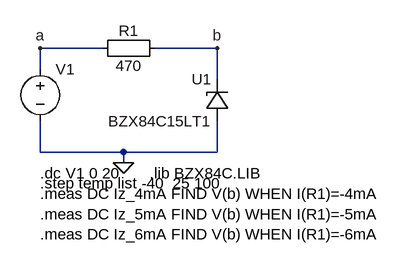
[diagram p0: schematic zener_va_15v.asc]
zener_va_15v.asc, the LTspice schematic file:
Version 4
SHEET 1 880 680
WIRE 112 -256 16 -256
WIRE 288 -256 192 -256
WIRE 16 -224 16 -256
WIRE 288 -208 288 -256
WIRE 16 -96 16 -144
WIRE 144 -96 16 -96
WIRE 288 -96 288 -144
WIRE 288 -96 144 -96
WIRE 144 -80 144 -96
FLAG 144 -80 0
FLAG 16 -256 a
FLAG 288 -256 b
SYMBOL Misc\\EuropeanResistor 208 -272 R90
WINDOW 0 5 56 VBottom 2
WINDOW 3 27 56 VTop 2
SYMATTR InstName R1
SYMATTR Value 470
SYMBOL zener-macro-model 304 -144 R180
WINDOW 0 24 64 Left 2
WINDOW 3 24 0 Left 2
SYMATTR InstName U1
SYMATTR Value BZX84C15LT1
SYMBOL voltage 16 -240 R0
SYMATTR InstName V1
SYMATTR Value ""
TEXT 16 -64 Left 2 !.dc V1 0 20
TEXT 16 -48 Left 2 !.step temp list -40  25 100
TEXT 184 -64 Left 2 !.lib BZX84C.LIB
TEXT 16 -32 Left 2 !.meas DC Iz_4mA FIND V(b) WHEN I(R1)=-4mA\n.meas DC Iz_5mA FIND V(b) WHEN I(R1)=-5mA\n.meas DC Iz_6mA FIND V(b) WHEN I(R1)=-6mA

The netlist it stands for:
* zener_va_15v.asc
R1 b a 470
XU1 0 b BZX84C15LT1  ; pins + -
V1 a 0
.dc V1 0 20
.step temp list -40  25 100
.lib BZX84C.LIB
.meas DC Iz_4mA FIND V(b) WHEN I(R1)=-4mA
.meas DC Iz_5mA FIND V(b) WHEN I(R1)=-5mA
.meas DC Iz_6mA FIND V(b) WHEN I(R1)=-6mA
.backanno
.end